# Altium schematic sheet MainSheetWithValues.SchDoc
size A4; SheetNumber: 1; SheetTotal: 1
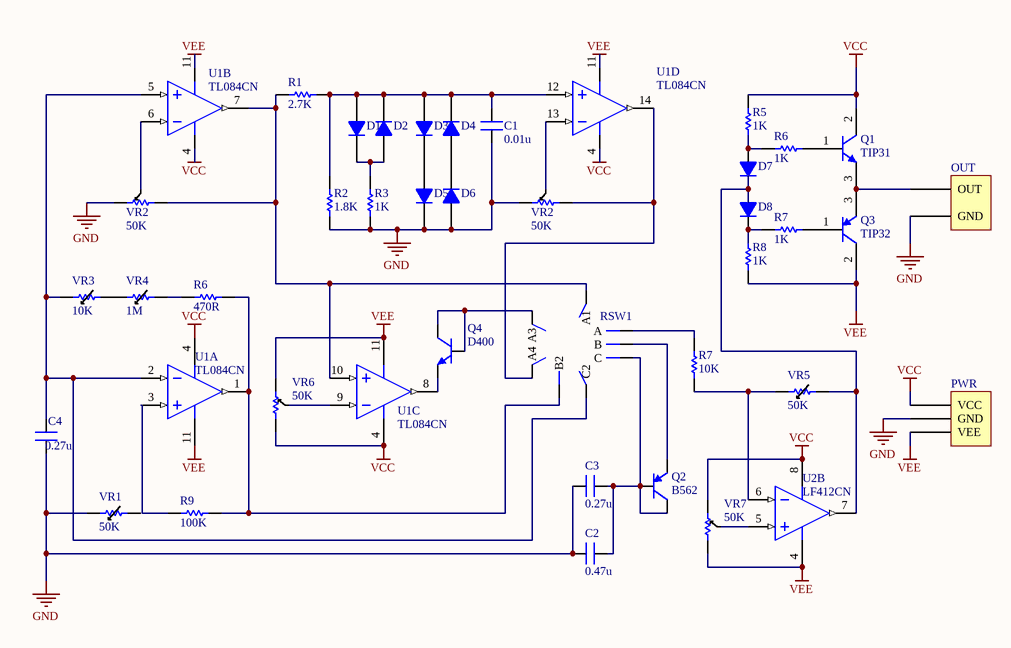
[diagram p0: MainSheetWithValues.SchDoc]

## Parts
(Parts that share a designator on the sheet are numbered #1, #2 ... from top to bottom, then left to right.)
C1  value 0.01u  [CAP3]  (hidden comment: Cap3)
C2  value 0.47u  [CAP4(200mil)]  (hidden comment: Cap3)
C3  value 0.27u  [CAP4(200mil)]  (hidden comment: Cap3)
C4  value 0.27u  [CAP4(200mil)]  (hidden comment: Cap3)
D1  1N4007  [1N4007]  (value not drawn)
D2  1N4007  [1N4007]  (value not drawn)
D3  1N4007  [1N4007]  (value not drawn)
D4  1N4007  [1N4007]  (value not drawn)
D5  1N4007  [1N4007]  (value not drawn)
D6  1N4007  [1N4007]  (value not drawn)
D7  1N4007  [1N4007]  (value not drawn)
D8  1N4007  [1N4007]  (value not drawn)
OUT  SigOut  [PWR2]  (value not drawn)
PWR  PWR3  [PWR3]  (value not drawn)
Q1  TIP31  [ONSC-TO-220-3-221A-09]
Q2  B562  [TO-92_ONS]
Q3  TIP32  [ONSC-TO-220-3-221A-09]
Q4  D400  [TO-92_ONS]
R1  value 2.7K  [RES]  (hidden comment: Res1)
R2  value 1.8K  [RES]  (hidden comment: Res1)
R3  value 1K  [RES]  (hidden comment: Res1)
R5  value 1K  [RES]  (hidden comment: Res1)
R6#1  value 1K  [RES]  (hidden comment: Res1)
R6#2  value 470R  [RES]  (hidden comment: Res1)
R7#1  value 1K  [RES]  (hidden comment: Res1)
R7#2  value 10K  [RES]  (hidden comment: Res1)
R8  value 1K  [RES]  (hidden comment: Res1)
R9  value 100K  [RES]  (hidden comment: Res1)
RSW1  RotarySwitch  [ROTARY_SWITCH]  (value not drawn)
U1  TL084CN  [N0014A]  (parts A,B,C,D of 4)
U2  LF412CN  [N08E]  (part B of 2)
VR1  value 50K  [VR_VOL_CTRL_2]  (hidden comment: VR2_2PIN)
VR2#1  value 50K  [VR_PRESET]  (hidden comment: VR3)
VR2#2  value 50K  [VR_PRESET]  (hidden comment: VR3)
VR3  value 10K  [VR_VOL_CTRL_2]  (hidden comment: VR2_2PIN)
VR4  value 1M  [VR_VOL_CTRL_2]  (hidden comment: VR2_2PIN)
VR5  value 50K  [VR_VOL_CTRL_2]  (hidden comment: VR2_2PIN)
VR6  value 50K  [VR_VOL_CTRL]  (hidden comment: VR3)
VR7  value 50K  [VR_VOL_CTRL]  (hidden comment: VR7)

## Nets
GND: C1.1 C2.2 C3.2 C4.1 D5.2(K) D6.1(A) OUT.2(GND) PWR.2(GND) R2.1 R3.1 VR1.1 VR2#1.2 VR2#2.2
VCC: PWR.1(VCC) Q1.2(C) R5.2 U1.4(VCC+) U2.8(V+) VR6.3 VR7.2
VEE: PWR.3(VEE) Q3.2(C) R8.1 U1.11(VCC-) U2.4(V-) VR6.2 VR7.3
NetC1_2: C1.2 D1.1(A) D2.2(K) D3.1(A) D4.2(K) R1.2 R2.2 U1.12(IN4+)
NetC2_1: C2.1 C3.1 Q2.2(C) Q2.3(B) RSW1.C
NetC4_2: C4.2 RSW1.C2 U1.2(IN1-) U1.5(IN2+) VR3.1
NetD1_2: D1.2(K) D2.1(A) R3.2
NetD3_2: D3.2(K) D5.1(A)
NetD4_1: D4.1(A) D6.2(K)
NetD7_1: D7.1(A) R5.1 R6#1.2
NetD7_2: D7.2(K) D8.1(A) U2.7(OUTB) VR5.2
NetD8_2: D8.2(K) R7#1.2 R8.2
NetOUT_1: OUT.1(OUT) Q1.3(E) Q3.3(E)
NetQ1_1: Q1.1(B) R6#1.1
NetQ2_1: Q2.1(E) RSW1.B
NetQ3_1: Q3.1(B) R7#1.1
NetQ4_1: Q4.1(E) U1.8(OUT3)
NetQ4_2: Q4.2(C) Q4.3(B) RSW1.A3
NetR1_1: R1.1 RSW1.A1 U1.7(OUT2) U1.10(IN3+) VR2#1.3
NetR6#2_1: R6#2.1 VR4.2
NetR6#2_2: R6#2.2 R9.2 RSW1.B2 U1.1(OUT1)
NetR7#2_1: R7#2.1 U2.6(INB-) VR5.1
NetR7#2_2: R7#2.2 RSW1.A
NetR9_1: R9.1 U1.3(IN1+)
NetRSW1_A4: RSW1.A4 U1.14(OUT4) VR2#2.3
NetU1_6: U1.6(IN2-) VR2#1.1
NetU1_9: U1.9(IN3-) VR6.1
NetU1_13: U1.13(IN4-) VR2#2.1
NetU2_5: U2.5(INB+) VR7.1
NetVR3_2: VR3.2 VR4.1

Not connected (* = marked no-connect by the designer): VR1 2

## Library data of the parts
C1-C4 = Cap3: Capacitor; Published: 23-Sep-2002; PackageReference: CAPR5-4X5; Publisher: Altium Limited; PackageDescription: Capacitor; 2 Leads
D1-D8 = 1N4007: 1 Amp General Purpose Rectifier; Published: 8-Jun-2000; LatestRevisionDate: 17-Jul-2002; LatestRevisionNote: Re-released for DXP Platform.; DatasheetVersion: 1998; PackageVersion: Aug-1999; PackageReference: DO-41; Publisher: Altium Limited; PackageDescription: Diode, Axial; Body 5.2 x 2.7 mm (LxDia. max), Lead Dia. 0.86 mm (max); Code_JEDEC: DO-204-AL; ComponentLink1Description: Manufacturer Link; ComponentLink1URL: http://www.fairchildsemi.com/; ComponentLink2Description: Datasheet; ComponentLink2URL: http://www.fairchildsemi.com/ds/1N%2F1N4001.pdf
Q1 = CMP-1048-01139-1: Complementary Silicon Plastic Power Transistor, 3-Pin TO-220, Tube; Manufacturer: On Semiconductor; IC Continuous (A): 3; Polarity: NPN; ComponentLink3URL: http://www.onsemi.com/pub_link/Collateral/221A-09.PDF; DatasheetVersion: Rev. 14; ComponentLink3Description: Package Specification; Packing: Tube; Mounting Technology: Through Hole; RoHS: FALSE; ComponentLink1Description: Manufacturer URL; PartNumber: TIP31; PackageDescription: 3-Pin Flange Mount, Vertical Straight Lead, Body 9.97 x 4.445 mm, Pitch 2.54 mm; fT Min (MHz): 3; PackageReference: TO-220-3-221A-09; PackageVersion: Rev. AG, 09/2011; ComponentLink2URL: http://www.onsemi.com/pub_link/Collateral/TIP31A-D.PDF; ComponentLink1URL: http://www.onsemi.com/; ComponentLink2Description: Datasheet
Q2 = A733: PNP General Purpose Transistor; Published: 8-Jun-2000; LatestRevisionDate: 15-Jan-2003; LatestRevisionNote: PCB Footprint 'BCY-W3/D4.7' replaced; DatasheetVersion: 1997; PackageVersion: Sep-1998; PackageReference: TO-92A; Publisher: Altium Limited; PackageDescription: TO, Flat Index; 3 In-Line, Axial Leads; Body Dia. 4.5mm; Leads 0.51 x 0.48 mm (max); ComponentLink1Description: Manufacturer Link; ComponentLink1URL: http://www.fairchildsemi.com/; ComponentLink2Description: Datasheet; ComponentLink2URL: http://www.fairchildsemi.com/ds/2N%2F2N3906.pdf
Q3 = CMP-1048-01071-1: Complementary Silicon Plastic Power Transistor, 3-Pin TO-220, Tube; Manufacturer: On Semiconductor; Polarity: PNP; IC Continuous (A): 3; ComponentLink1URL: http://www.onsemi.com/; RoHS: FALSE; ComponentLink3URL: http://www.onsemi.com/pub_link/Collateral/221A-09.PDF; PartNumber: TIP32; Mounting Technology: Through Hole; PackageDescription: 3-Pin Flange Mount, Vertical Straight Lead, Body 9.97 x 4.445 mm, Pitch 2.54 mm; ComponentLink2Description: Datasheet; ComponentLink3Description: Package Specification; ComponentLink1Description: Manufacturer URL; PackageVersion: Rev. AG, 09/2011; ComponentLink2URL: http://www.onsemi.com/pub_link/Collateral/TIP31A-D.PDF; Packing: Tube; DatasheetVersion: Rev. 14; fT Min (MHz): 3; PackageReference: TO-220-3-221A-09
Q4 = C828: NPN General Purpose Transistor; Published: 8-Jun-2000; LatestRevisionDate: 15-Jan-2003; LatestRevisionNote: PCB Footprint 'BCY-W3/D4.7' replaced; DatasheetVersion: 1997; PackageVersion: Sep-1998; PackageReference: TO-92A; Publisher: Altium Limited; PackageDescription: TO, Flat Index; 3 In-Line, Axial Leads; Body Dia. 4.5mm; Leads 0.51 x 0.48 mm (max); ComponentLink1Description: Manufacturer Link; ComponentLink1URL: http://www.fairchildsemi.com/; ComponentLink2Description: Datasheet; ComponentLink2URL: http://www.fairchildsemi.com/ds/2N%2F2N3904.pdf
R1-R3 R5 R6#1 R6#2 R7#1 R7#2 R8 R9 = Res1: Resistor; Published: 8-Jun-2000; LatestRevisionDate: 17-Jul-2002; LatestRevisionNote: Re-released for DXP Platform.; PackageReference: AXIAL-0.3; Publisher: Altium Limited; PackageDescription: Axial Device, Thru-Hole; 2 Leads; 0.3 in Pin Spacing
U1 = CMP-0017-00818-2: JFET-Input Operational Amplifier, 7 to 36 V, 0 to 70 degC, 14-pin DIP (N14), Pb-Free (RoHS); Manufacturer: Texas Instruments; Rating: Catalog; Iq per channel(Max)(mA): 2.8; Number of Channels: 4; IIB(Max)(pA): 400; Vio (25C)(Max)(mV): 15; GBW(Typ)(MHz): 3; Total Supply Voltage(Max)(+5V is 5, +/-5V is 10): 36; Vn at 1kHz(Typ)(nV/rtHz): 18; Sub Family: General Purpose Amplifier, High Supply Voltage Amplifier (>=30V); Slew Rate(Typ)(V/us): 13; Total Supply Voltage(Min)(+5V is 5, +/-5V is 10): 7; CMRR(Min)(dB): 70; ComponentLink3Description: Package Specification; PackageDescription: 14-Pin Plastic In-Line, Body 19.305 x 6.35 mm, Pitch 2.54 mm; ComponentLink1Description: Manufacturer URL; PackageVersion: 4040049/E, 12/2002; Eco-Plan: Pb-Free (RoHS); ComponentLink2URL: http://www.ti.com/lit/ds/symlink/tl084.pdf; ComponentLink1URL: http://www.ti.com/; DatasheetVersion: SLOS081G; Mounting Technology: Through Hole; PartNumber: TL084CN; Offset Drift(Typ)(uV/C): 18; PackageReference: N0014A; ComponentLink3URL: http://www.ti.com/lit/ml/mpdi002c/mpdi002c.pdf; ComponentLink2Description: Datasheet; Code_JEDEC: MS-001
U2 = CMP-0055-00193-2: Low Offset, Low Drift Dual JFET Input Operational Amplifier, 8-pin MDIP; Manufacturer: National Semiconductor; PowerWise: N; CompType: Amplifiers; PackageTopMarking: NSUZXYTTE#*LF*412CN; ComponentLink1Description: LF412 Datasheet; RevisionNote: Component URLs added; PackageReference: N08E; ComponentLink3URL: http://www.national.com/packaging/folders/n08e.html; ComponentLink2URL: http://www.national.com/pf/LF/LF412.html; RoHS: N; DatasheetVersion: Jan-2010; ComponentLink2Description: LF412 Web Page; PackageDescription: MDIP, .365 x .250 x .130in, 8 Lead, .100in Pitch; PinCount: 8; ComponentLink1URL: http://www.national.com/ds/LF/LF412.pdf; PackageVersion: revG, May-2006; ComponentLink3Description: N08E Package Page; Code_JEDEC: MS-001-BA
VR7 = VR3